# Altium project PCB_Project.PrjPcb
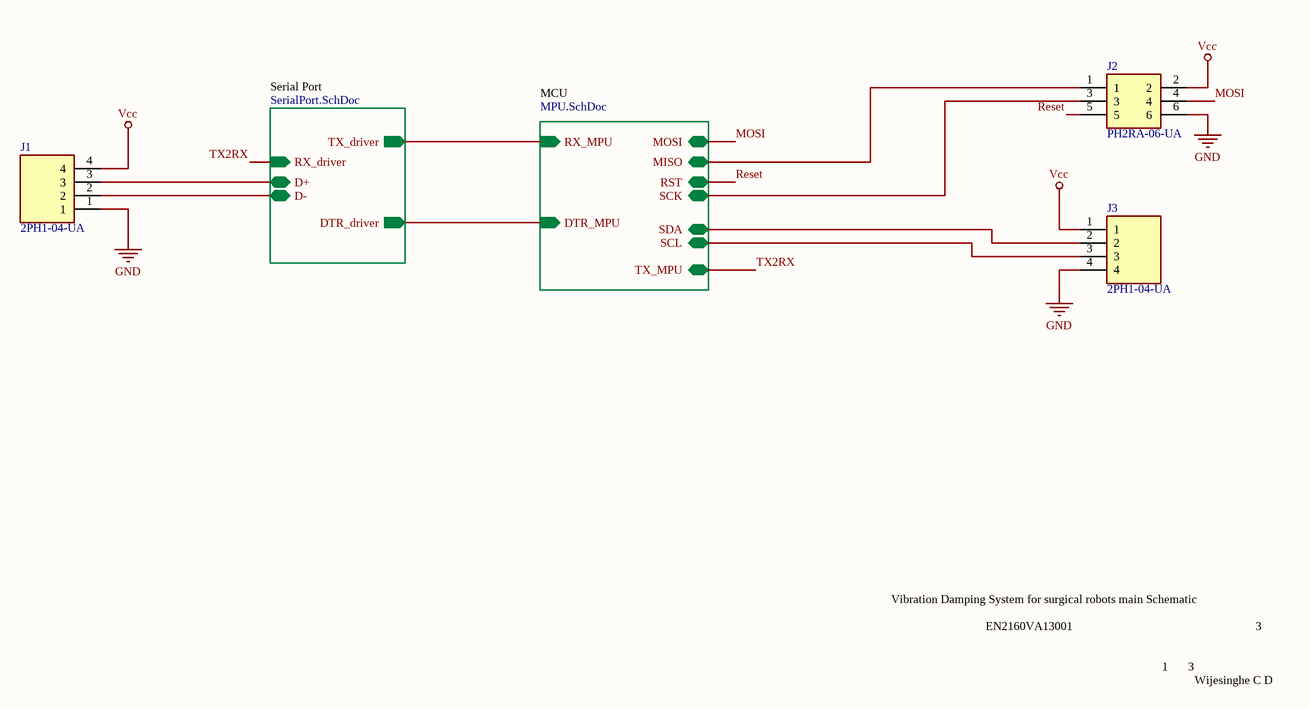
[diagram p0: Schematic.SchDoc]
3 sheets, 23 parts. Net scope: hierarchical (ports join the sheet entries above them; power ports are global).
Board files: PCB.PcbDoc, PCB2.PcbDoc
Sheets:
  Schematic.SchDoc
    MCU = MPU.SchDoc
    Serial Port = SerialPort.SchDoc

## Sheet Schematic.SchDoc: Vibration Damping System for surgical robots
size A4; SheetNumber: 1; SheetTotal: 2

### Parts
J1  2PH1-04-UA  [HDRV4W50P0X200_1X4_800X200X590P]
J2  PH2RA-06-UA  [HDRRA6W64P254_2X3_762X250X500P]
J3  2PH1-04-UA  [HDRV4W50P0X200_1X4_800X200X590P]

### Sub-sheets
MCU = MPU.SchDoc: SCK (bidir), SCL (bidir), TX_MPU (bidir), RX_MPU (in), DTR_MPU (in), MISO (bidir), MOSI (bidir), RST (bidir), SDA (bidir)
Serial Port = SerialPort.SchDoc: RX_driver (in), TX_driver (out), DTR_driver (out), D+ (bidir), D- (bidir)

### Nets
GND: J1.1 J2.6 J3.4
Vcc: J1.4 J2.2 J3.1
MISO: J2.1 ; sheet MCU/MISO
MOSI: J2.4 ; sheet MCU/MOSI
Reset: J2.5 ; sheet MCU/RST
RX: sheet MCU/RX_MPU, sheet Serial Port/TX_driver
SCK: J2.3 ; sheet MCU/SCK
SCL: J3.3 ; sheet MCU/SCL
SDA: J3.2 ; sheet MCU/SDA
TX2RX: sheet MCU/TX_MPU, sheet Serial Port/RX_driver  [project net TX]
NetC3_2: sheet MCU/DTR_MPU, sheet Serial Port/DTR_driver
NetJ1_2: J1.2 ; sheet Serial Port/D-
NetJ1_3: J1.3 ; sheet Serial Port/D+

### Notes on the sheet
- Vibration Damping System for surgical robots main Schematic <https://github.com/Vibration-Analysis/Vibration-Analysing-system-for-Robot-arms>
- EN2160VA13001
- 1
- 3
- Wijesinghe C D
- Title:
- Author:
- Approved:
- Size:
- Date:
- Git Hash:
- A4
- Prj:
- SW Version:
- Variant:
- Edited:
- CONFIDENTIAL
- File:

### Library data of the parts
J1 J3 = 2PH1-04-UA: Connector; Manufacturer_Name: Adam Tech; Datasheet Link: https://datasheet.datasheetarchive.com/originals/distributors/Datasheets_SAMA/1340c19c3c34daa1512378d1cc9f6be0.pdf; Height: 5.9mm; Manufacturer_Part_Number: 2PH1-04-UA; Mouser Part Number: 737-2PH1-04-UA; Mouser Price/Stock: https://www.mouser.co.uk/ProductDetail/Adam-Tech/2PH1-04-UA?qs=HoCaDK9Nz5foLmmthkPmJw%3D%3D
J2 = PH2RA-06-UA: Connector; Manufacturer_Name: Adam Tech; Datasheet Link: https://static6.arrow.com/aropdfconversion/38d430c3bbd26836f869f57df34a7f03090e7de1/782downloader.phppph2ra-xx-ua.pdf; Height: 5mm; Manufacturer_Part_Number: PH2RA-06-UA; Arrow Part Number: PH2RA-06-UA; Arrow Price/Stock: https://www.arrow.com/en/products/ph2ra-06-ua/adam-tech

## Sheet MPU.SchDoc
size A4; SheetNumber: 2; SheetTotal: 3
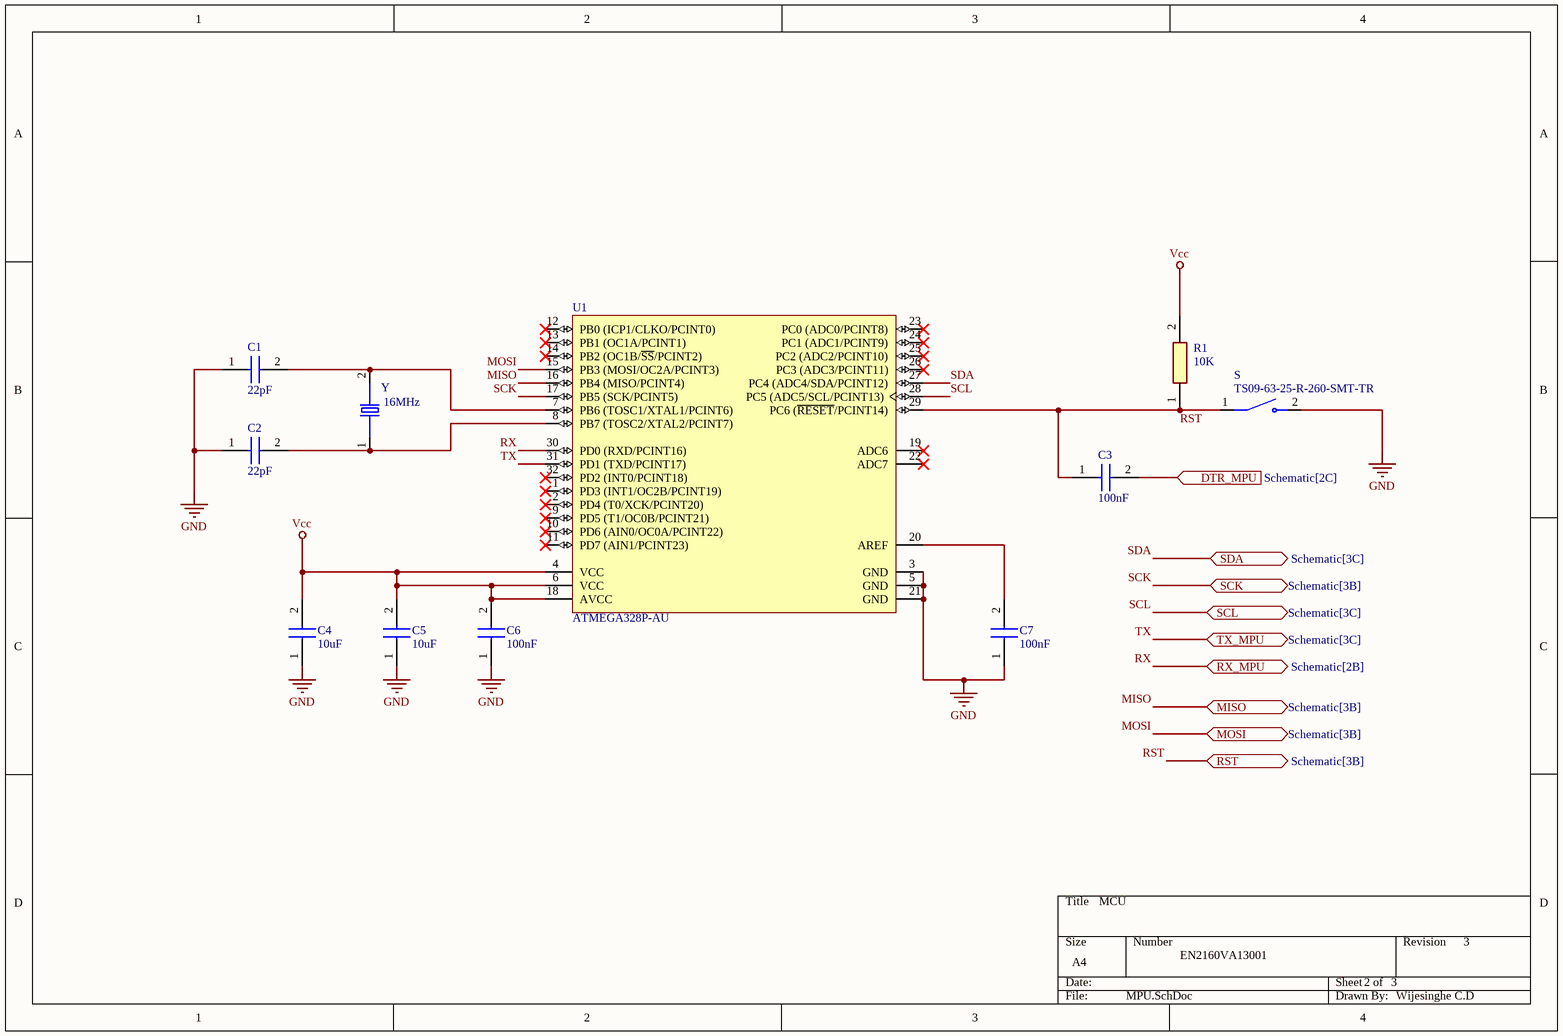
[diagram p1: MPU.SchDoc]

### Parts
C1  22pF  [C0805]
C2  22pF  [C0805]
C3  100nF  [CAPC2013X137N]
C4  10uF  [CAPC2012X145N]
C5  10uF  [CAPC2012X145N]
C6  100nF  [CAPC2013X137N]
C7  100nF  [CAPC2013X137N]
R1  10K  [RESC2013X65N]
S  TS09-63-25-R-260-SMT-TR  [SW_TS09-63-25-R-260-SMT-TR]
U1  ATMEGA328P-AU  [ATML-32A_M]
Y  16MHz  [XTAL_FOXSDLF/160-20]

### Ports
DTR_MPU (in, see Schematic[2C]), MISO (bidir, see Schematic[3B]), MOSI (bidir, see Schematic[3B]), RST (bidir, see Schematic[3B]), RX_MPU (bidir, see Schematic[2B]), SCK (bidir, see Schematic[3B]), SCL (bidir, see Schematic[3C]), SDA (bidir, see Schematic[3C]), TX_MPU (bidir, see Schematic[3C])

### Nets
GND: C1.1 C2.1 C4.1 C5.1 C6.1 C7.1 S.2 U1.3(GND) U1.5(GND) U1.21(GND)
Vcc: C4.2 C5.2 C6.2 R1.2 U1.4(VCC) U1.6(VCC) U1.18(AVCC)
MISO: U1.16(PB4_(MISO/PCINT4)) ; port MISO
MOSI: U1.15(PB3_(MOSI/OC2A/PCINT3)) ; port MOSI
RST: C3.1 R1.1 S.1 U1.29(PC6_(~{RESET}/PCINT14)) ; port RST  [project net Reset]
RX: U1.30(PD0_(RXD/PCINT16)) ; port RX_MPU
SCK: U1.17(PB5_(SCK/PCINT5)) ; port SCK
SCL: U1.28(PC5_(ADC5/SCL/PCINT13)) ; port SCL
SDA: U1.27(PC4_(ADC4/SDA/PCINT12)) ; port SDA
TX: U1.31(PD1_(TXD/PCINT17)) ; port TX_MPU
NetC1_2: C1.2 U1.7(PB6_(TOSC1/XTAL1/PCINT6)) Y.2
NetC2_2: C2.2 U1.8(PB7_(TOSC2/XTAL2/PCINT7)) Y.1
NetC3_2: C3.2 ; port DTR_MPU
NetC7_2: C7.2 U1.20(AREF)

Not connected (* = marked no-connect by the designer): U1 1(PD3_(INT1/OC2B/PCINT19))* 2(PD4_(T0/XCK/PCINT20))* 9(PD5_(T1/OC0B/PCINT21))* 10(PD6_(AIN0/OC0A/PCINT22))* 11(PD7_(AIN1/PCINT23))* 12(PB0_(ICP1/CLKO/PCINT0))* 13(PB1_(OC1A/PCINT1))* 14(PB2_(OC1B/~{SS}/PCINT2))* 19(ADC6)* 22(ADC7)* 23(PC0_(ADC0/PCINT8))* 24(PC1_(ADC1/PCINT9))* 25(PC2_(ADC2/PCINT10))* 26(PC3_(ADC3/PCINT11))* 32(PD2_(INT0/PCINT18))*

### Notes on the sheet
- MCU
- EN2160VA13001
- 2
- 3
- Wijesinghe C.D

### Library data of the parts
C1 C2 = C0805X220J1GACTU: Capacitor; Manufacturer_Name: KEMET; Datasheet Link: https://content.kemet.com/datasheets/KEM_C1062_C0G_FT-CAP_SMD.pdf; Height: 1.1mm; Manufacturer_Part_Number: C0805X220J1GACTU; Mouser Part Number: 80-C0805X220J1GACTU; Mouser Price/Stock: https://www.mouser.co.uk/ProductDetail/KEMET/C0805X220J1GACTU?qs=ds50AKTGxA9gC%252BgDVpAXPw%3D%3D
C3 C6 C7 = 0805B104K500NT: Capacitor; Manufacturer_Name: Novacap; Datasheet Link: https://componentsearchengine.com/Datasheets/1/0805B104K500NT.pdf; Height: 1.37mm; Manufacturer_Part_Number: 0805B104K500NT; Mouser Part Number: 767-0805B104K500NT; Mouser Price/Stock: https://www.mouser.com/Search/Refine.aspx?Keyword=767-0805B104K500NT
C4 C5 = GCM21BC71E106KE36K: Capacitor; Manufacturer_Name: Murata Electronics; Datasheet Link: https://search.murata.co.jp/Ceramy/image/img/A01X/G101/ENG/GRM21BC71E106KE11-01.pdf; Height: 1.45mm; Manufacturer_Part_Number: GCM21BC71E106KE36K; Mouser Part Number: 81-GCM21B71E106KE36K; Mouser Price/Stock: https://www.mouser.co.uk/ProductDetail/Murata-Electronics/GCM21BC71E106KE36K?qs=By6Nw2ByBD3dg3yZS4KZOA%3D%3D
R1 = 0805W8F1002T5E: Resistor; Manufacturer_Name: UniOhm; Height: 0.65mm; Manufacturer_Part_Number: 0805W8F1002T5E
U1 = CMP-020-00003-3: 8-Bit Microcontroller with 32 KBytes In-System Programmable Flash, 23 I/Os, -40 to 85 degC, 32-Pin TQFP (32A), RoHS, Tray; Manufacturer: Atmel; PWM Channels: 6; Frequency: 20MHz; RAM Size: 2KB; ADC Channels: 8; Max Supply Voltage: 5.5V; Density: 32KB; USB Channels: 0; I/Os: 23; Min Supply Voltage: 1.8V; Interface: USART; Package Reference: 32A; Package Description: 32-Pin Thin Profile Plastic Quad Flat Package, Body 7 x 7 mm, Pitch 0.8 mm; Max Operating Temperature: 85°C; Mounting Technology: SM; Datasheet URL: http://www.atmel.com/images/Atmel-8271-8-bit-AVR-Microcontroller-ATmega48A-48PA-88A-88PA-168A-168PA-328-328P_datasheet_Complete.pdf; Pins: 32; Packaging: Tray; RoHS Compliant: True; Max Clock Frequency: 20MHz; Ethernet Channels: 0; Clock Frequency: 20MHz; Case/Package: TQFP; Manufacturer URL: http://www.atmel.com/; Datasheet Version: Rev. 8271J, 11/2015; Package Quantity: 250; Min Operating Temperature: -40°C
Y = FOXSDLF/160-20: Microprocessor, Crystal; 16 Mhz; + 30 Ppm @ Degc; 7 Pf (Max.); 20 Pf; -20 Deg; MF: Fox Electronics; Package: HC49SD Fox Electronics; Price: None; Value: *; SnapEDA_Link: https://www.snapeda.com/parts/FOXSDLF/160-20/Fox+Electronics/view-part/?ref=snap; MP: FOXSDLF/160-20; Availability: In Stock; Check_prices: https://www.snapeda.com/parts/FOXSDLF/160-20/Fox+Electronics/view-part/?ref=eda
S = TS09-63-25-R-260-SMT-TR: Availability: Unavailable; Price: None; Package: None; Value: *; MP: TS09-63-25-R-260-SMT-TR

## Sheet SerialPort.SchDoc
size A4; SheetNumber: 3; SheetTotal: 2
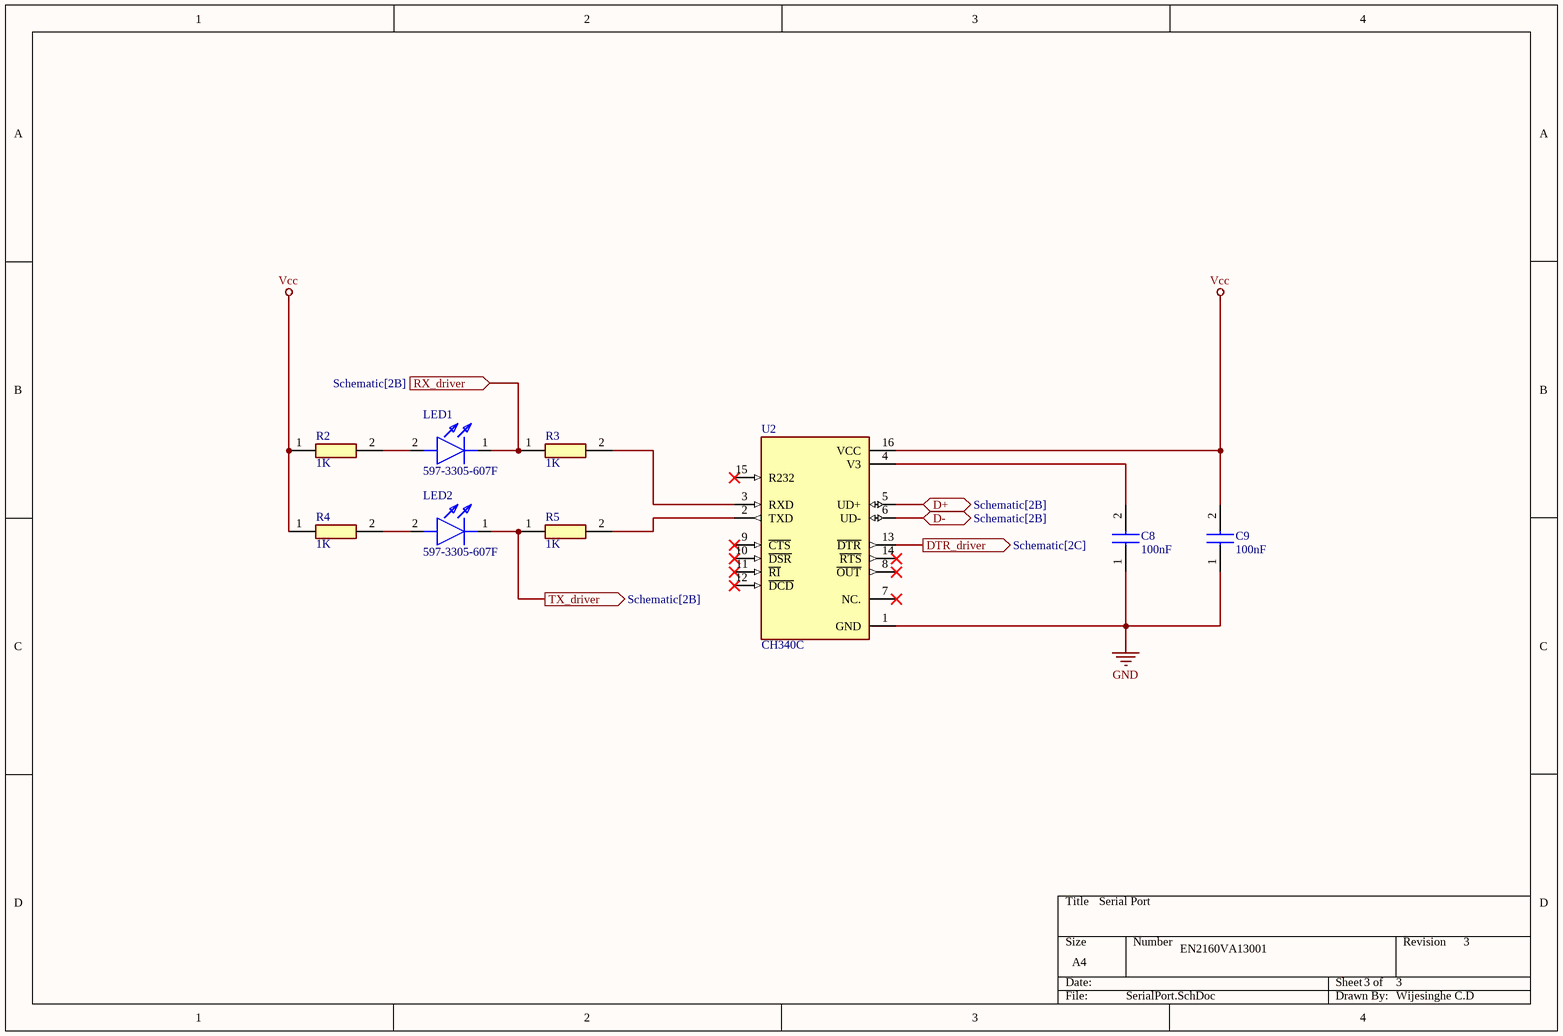
[diagram p2: SerialPort.SchDoc]

### Parts
C8  100nF  [CAPC2013X137N]
C9  100nF  [CAPC2013X137N]
LED1  597-3305-607F  [LEDC2012X70N]
LED2  597-3305-607F  [LEDC2012X70N]
R2  1K  [RESC2012X60N]
R3  1K  [RESC2012X60N]
R4  1K  [RESC2012X60N]
R5  1K  [RESC2012X60N]
U2  CH340C  [SOIC127P600X180-16N]

### Ports
D+ (bidir, see Schematic[2B]), D- (bidir, see Schematic[2B]), DTR_driver (out, see Schematic[2C]), RX_driver (in, see Schematic[2B]), TX_driver (out, see Schematic[2B])

### Nets
GND: C8.1 C9.1 U2.1(GND)
Vcc: C9.2 R2.1 R4.1 U2.16(VCC)
RX: LED2.1(K) R5.1 ; port TX_driver
TX: LED1.1(K) R3.1 ; port RX_driver
NetC3_2: U2.13(~{DTR}) ; port DTR_driver
NetC8_2: C8.2 U2.4(V3)
NetJ1_2: U2.6(UD-) ; port D-
NetJ1_3: U2.5(UD+) ; port D+
NetLED1_2: LED1.2(A) R2.2
NetLED2_2: LED2.2(A) R4.2
NetR3_2: R3.2 U2.3(RXD)
NetR5_2: R5.2 U2.2(TXD)

Not connected (* = marked no-connect by the designer): U2 7(NC.)* 8(~{OUT})* 9(~{CTS})* 10(~{DSR})* 11(~{RI})* 12(~{DCD})* 14(~{RTS})* 15(R232)*

### Notes on the sheet
- Serial Port
- EN2160VA13001
- 3
- Wijesinghe C.D

### Library data of the parts
C8 C9 = 0805B104K500NT: Capacitor; Manufacturer_Name: Novacap; Datasheet Link: https://componentsearchengine.com/Datasheets/1/0805B104K500NT.pdf; Height: 1.37mm; Manufacturer_Part_Number: 0805B104K500NT; Mouser Part Number: 767-0805B104K500NT; Mouser Price/Stock: https://www.mouser.com/Search/Refine.aspx?Keyword=767-0805B104K500NT
LED1 LED2 = 597-3305-607F: LED; Manufacturer_Name: Dialight; Datasheet Link: https://mouser.componentsearchengine.com/Datasheets/1/597-3305-607F.pdf; Height: 0.7mm; Manufacturer_Part_Number: 597-3305-607F; Mouser Part Number: 645-597-3305-607F; Mouser Price/Stock: https://www.mouser.com/Search/Refine.aspx?Keyword=645-597-3305-607F; Arrow Part Number: 597-3305-607F; Arrow Price/Stock: https://www.arrow.com/en/products/597-3305-607f/dialight
R2-R5 = RC0805FR-071KL: Resistor; Manufacturer_Name: YAGEO; Datasheet Link: https://www.yageo.com/upload/media/product/productsearch/datasheet/rchip/PYu-RC_Group_51_RoHS_L_11.pdf; Height: 0.6mm; Manufacturer_Part_Number: RC0805FR-071KL; Mouser Part Number: 603-RC0805FR-071KL; Mouser Price/Stock: https://www.mouser.co.uk/ProductDetail/YAGEO/RC0805FR-071KL?qs=1ogmaHw32WJjeGY0DHXakQ%3D%3D; Arrow Part Number: RC0805FR-071KL; Arrow Price/Stock: https://www.arrow.com/en/products/rc0805fr-071kl/yageo?region=europe
U2 = CH340C: USB to serial chip CH340; MF: WCH; Price: None; Availability: Not in stock; MP: CH340C; Package: None; SnapEDA_Link: https://www.snapeda.com/parts/CH340C/WCH/view-part/?ref=snap; Check_prices: https://www.snapeda.com/parts/CH340C/WCH/view-part/?ref=eda; Value: *

## Nets that join several sheets
GND: Schematic (J1.1 J2.6 J3.4), MPU (10 pins), SerialPort (C8.1 C9.1 U2.1)
Vcc: Schematic (J1.4 J2.2 J3.1), MPU (7 pins), SerialPort (C9.2 R2.1 R4.1 U2.16)
MISO: Schematic (J2.1), MPU (U1.16)
MOSI: Schematic (J2.4), MPU (U1.15)
NetC3_2: MPU (C3.2), SerialPort (U2.13)
NetJ1_2: Schematic (J1.2), SerialPort (U2.6)
NetJ1_3: Schematic (J1.3), SerialPort (U2.5)
Reset: Schematic (J2.5), MPU (C3.1 R1.1 S.1 U1.29)
RX: MPU (U1.30), SerialPort (LED2.1 R5.1)
SCK: Schematic (J2.3), MPU (U1.17)
SCL: Schematic (J3.3), MPU (U1.28)
SDA: Schematic (J3.2), MPU (U1.27)
TX: MPU (U1.31), SerialPort (LED1.1 R3.1)